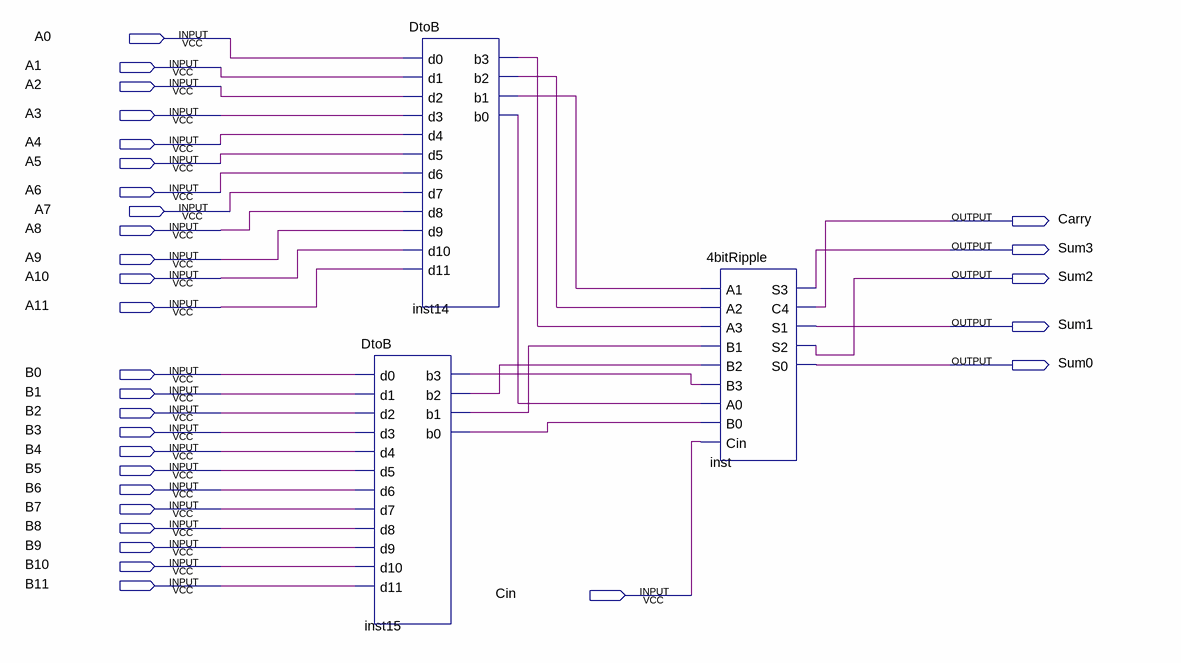
[diagram p0: schematic sheet]
// Quartus schematic practice2.bdf as structural Verilog: 3 symbols, 30 pins
module practice2 (
  input  A0,
  input  A1,
  input  A2,
  input  A3,
  input  A4,
  input  A5,
  input  A6,
  input  A7,
  input  A8,
  input  A9,
  input  A10,
  input  A11,
  input  B0,
  input  B1,
  input  B2,
  input  B3,
  input  B4,
  input  B5,
  input  B6,
  input  B7,
  input  B8,
  input  B9,
  input  B10,
  input  B11,
  input  Cin,
  output Carry,
  output Sum3,
  output Sum2,
  output Sum1,
  output Sum0
);

  wire inst14_b0, inst14_b1, inst14_b2, inst14_b3, inst15_b0, inst15_b1, inst15_b2, inst15_b3;

  DtoB inst14 (
    .d0(A0), .d1(A1), .d2(A2), .d3(A3), .d4(A4), .d5(A5), .d6(A6), .d7(A7), .d8(A8), .d9(A9), .d10(A10),
    .d11(A11), .b3(inst14_b3), .b2(inst14_b2), .b1(inst14_b1), .b0(inst14_b0));
  DtoB inst15 (
    .d0(B0), .d1(B1), .d2(B2), .d3(B3), .d4(B4), .d5(B5), .d6(B6), .d7(B7), .d8(B8), .d9(B9), .d10(B10),
    .d11(B11), .b3(inst15_b3), .b2(inst15_b2), .b1(inst15_b1), .b0(inst15_b0));
  \4bitRipple  inst (
    .A1(inst14_b1), .A2(inst14_b2), .A3(inst14_b3), .B1(inst15_b1), .B2(inst15_b2), .B3(inst15_b3),
    .A0(inst14_b0), .B0(inst15_b0), .Cin(Cin), .S3(Sum3), .C4(Carry), .S1(Sum1), .S2(Sum2), .S0(Sum0));
endmodule
